# EAGLE design Midi4U (EAGLE 5.11)
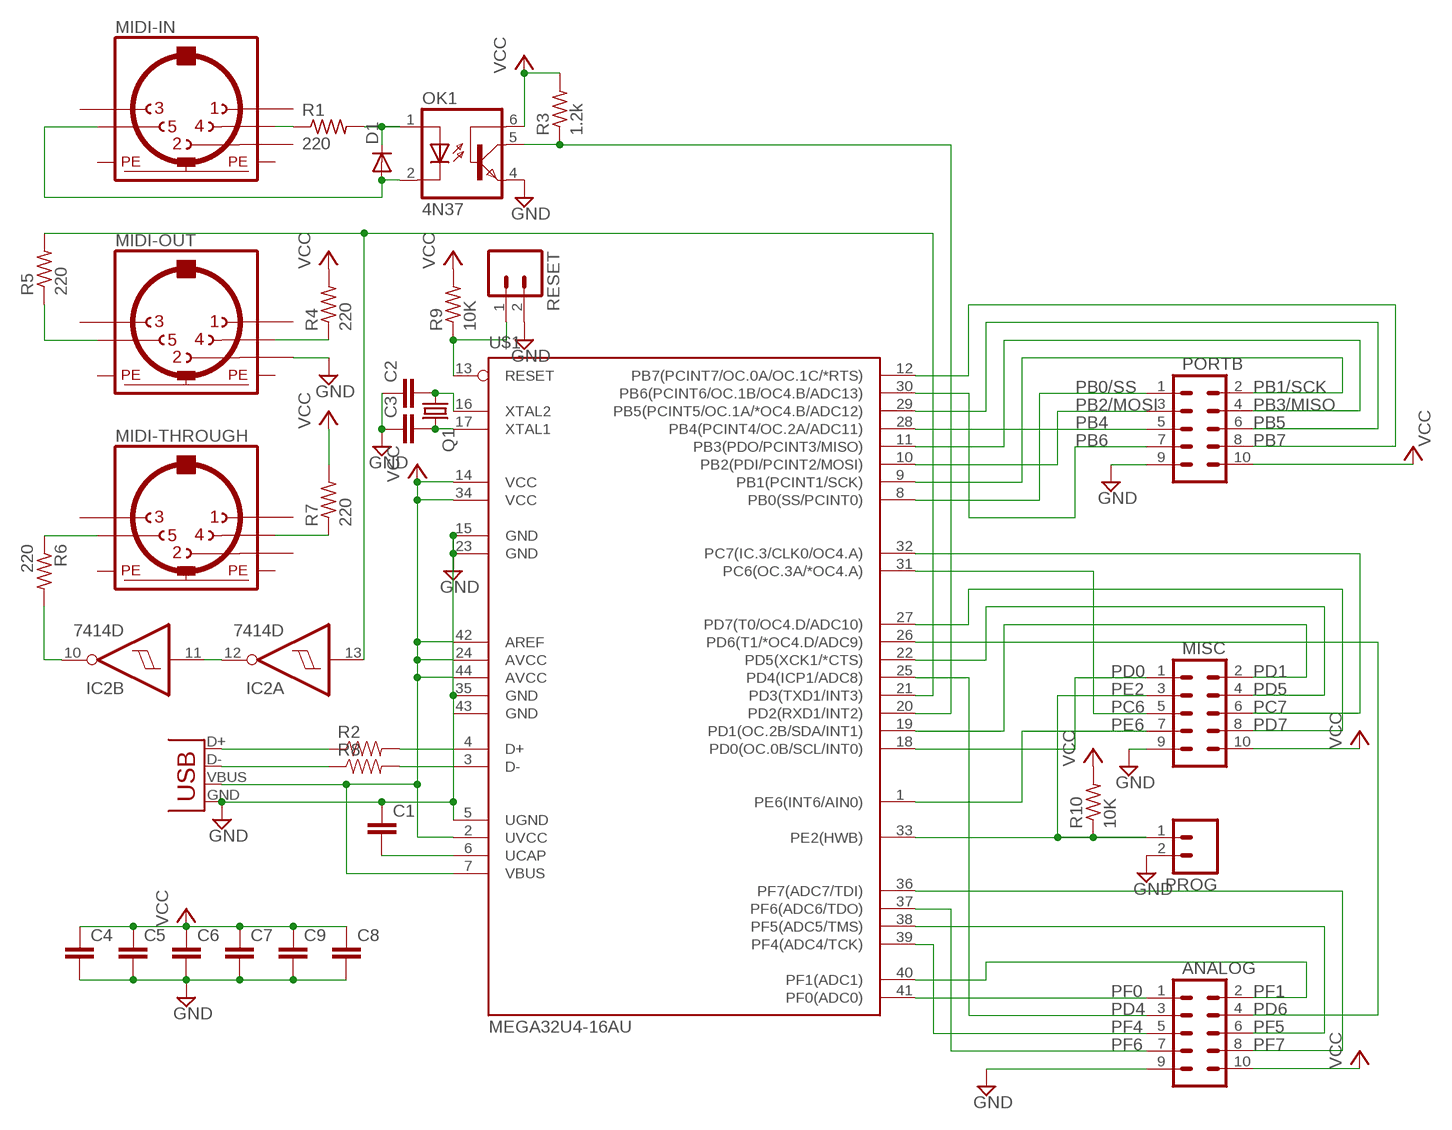
[diagram p0: schematic, sheet 1]

## Parts
ANALOG  M05X2PTH  [AVR_ICSP]
C1  CAP0805  [0805]
C2  CAP0805  [0805]
C3  CAP0805  [0805]
C4  CAP0805  [0805]
C5  CAP0805  [0805]
C6  CAP0805  [0805]
C7  CAP0805  [0805]
C8  CAP0805  [0805]
C9  CAP0805  [0805]
D1  DIODESOD  [SOD-323]
IC2  7414D  [SO14]
MIDI-IN  MAB5SH  [MAB5SH]
MIDI-OUT  MAB5SH  [MAB5SH]
MIDI-THROUGH  MAB5SH  [MAB5SH]
MISC  M05X2PTH  [AVR_ICSP]
OK1  4N37  [DIL06]
PORTB  M05X2PTH  [AVR_ICSP]
PROG  M02PTH  [1X02]
Q1  CRYSTALHC49S  [HC49/S]
R1  220  R-US_R0805  [R0805]
R2  RESISTOR  [0805]
R3  1.2k  R-US_M0805  [M0805]
R4  220  R-US_R0805  [R0805]
R5  220  R-US_R0805  [R0805]
R6  220  R-US_M0805  [M0805]
R7  220  R-US_M0805  [M0805]
R8  RESISTOR  [0805]
R9  10K  R-US_R0805  [R0805]
R10  10K  R-US_R0805  [R0805]
RESET  M02PTH  [1X02]
U$1  MEGA32U4-16AU  [TQFP44]
X1  USBPTH  [USB-B-PTH]

## Nets
GND: ANALOG.9 C1.1 C2.1 C3.1 C4.2 C5.2 C6.2 C7.2 C8.2 C9.2 MIDI-OUT.2 MISC.9 OK1.4(EMI) PORTB.9 PROG.2 RESET.2 U$1.5(UGND) U$1.15(GND) U$1.23(GND) U$1.35(GND) U$1.43(GND) X1.GND
N$1: R9.1 RESET.1 U$1.13(RESET)
N$2: D1.1(C) OK1.1(A) R1.2
N$3: R2.2 U$1.4(D+)
N$4: MIDI-IN.4 R1.1
N$5: MIDI-OUT.5 R5.1
N$6: MIDI-OUT.4 R4.1
N$7: D1.2(A) MIDI-IN.5 OK1.2(C)
N$8: C1.2 U$1.6(UCAP)
N$9: R2.1 X1.D+
N$10: IC2.11(B:I) IC2.12(A:O)
N$11: IC2.10(B:O) R6.2
N$12: MIDI-THROUGH.5 R6.1
N$13: MIDI-THROUGH.4 R7.1
N$14: R8.2 U$1.3(D-)
N$15: R8.1 X1.D-
N$17: C3.2 Q1.2 U$1.17(XTAL1)
N$18: C2.2 Q1.1 U$1.16(XTAL2)
PB0/SS: PORTB.1 U$1.8(PB0(SS/PCINT0))
PB1/SCK: PORTB.2 U$1.9(PB1(PCINT1/SCK))
PB2/MOSI: PORTB.3 U$1.10(PB2(PDI/PCINT2/MOSI))
PB3/MISO: PORTB.4 U$1.11(PB3(PDO/PCINT3/MISO))
PB4: PORTB.5 U$1.28(PB4(PCINT4/OC.2A/ADC11))
PB5: PORTB.6 U$1.29(PB5(PCINT5/OC.1A/*OC4.B/ADC12))
PB6: PORTB.7 U$1.30(PB6(PCINT6/OC.1B/OC4.B/ADC13))
PB7: PORTB.8 U$1.12(PB7(PCINT7/OC.0A/OC.1C/*RTS))
PC6: MISC.5 U$1.31(PC6(OC.3A/*OC4.A))
PC7: MISC.6 U$1.32(PC7(IC.3/CLK0/OC4.A))
PD0: MISC.1 U$1.18(PD0(OC.0B/SCL/INT0))
PD1: MISC.2 U$1.19(PD1(OC.2B/SDA/INT1))
PD4: ANALOG.3 U$1.25(PD4(ICP1/ADC8))
PD5: MISC.4 U$1.22(PD5(XCK1/*CTS))
PD6: ANALOG.4 U$1.26(PD6(T1/*OC4.D/ADC9))
PD7: MISC.8 U$1.27(PD7(T0/OC4.D/ADC10))
PE2: MISC.3 PROG.1 R10.1 U$1.33(PE2(HWB))
PE6: MISC.7 U$1.1(PE6(INT6/AIN0))
PF0: ANALOG.1 U$1.41(PF0(ADC0))
PF1: ANALOG.2 U$1.40(PF1(ADC1))
PF4: ANALOG.5 U$1.39(PF4(ADC4/TCK))
PF5: ANALOG.6 U$1.38(PF5(ADC5/TMS))
PF6: ANALOG.7 U$1.37(PF6(ADC6/TDO))
PF7: ANALOG.8 U$1.36(PF7(ADC7/TDI))
RX: IC2.13(A:I) R5.2 U$1.21(PD3(TXD1/INT3))
TX: OK1.5(COL) R3.1 U$1.20(PD2(RXD1/INT2))
VCC: ANALOG.10 C4.1 C5.1 C6.1 C7.1 C8.1 C9.1 MISC.10 OK1.6(BAS) PORTB.10 R3.2 R4.2 R7.2 R9.2 R10.2 U$1.2(UVCC) U$1.7(VBUS) U$1.14(VCC) U$1.24(AVCC) U$1.34(VCC) U$1.42(AREF) U$1.44(AVCC) X1.VBUS
Unconnected: IC2.1(D:I) IC2.2(D:O) IC2.3(E:I) IC2.4(E:O) IC2.5(F:I) IC2.6(F:O) IC2.8(C:O) IC2.9(C:I) MIDI-IN.1 MIDI-IN.2 MIDI-IN.3 MIDI-OUT.1 MIDI-OUT.3 MIDI-THROUGH.1 MIDI-THROUGH.2 MIDI-THROUGH.3

## Power pins joined to a net without a drawn wire
GND: IC2.7(P:GND)
PE: MIDI-IN.PE MIDI-IN.PE@(PE) MIDI-OUT.PE MIDI-OUT.PE@(PE) MIDI-THROUGH.PE MIDI-THROUGH.PE@(PE)
VCC: IC2.14(P:VCC)

## Library data of the parts
ANALOG MISC PORTB = 3d:M05X2: Header 5x2 Standard 10-pin dual row 0.1" header. Commonly used with AVR-ISP. Use with Spark Fun Electronics SKU: PRT-00778
C1-C9 = 3d:CAP: Capacitor Standard 0603 ceramic capacitor, and 0.1" leaded capacitor.
D1 = 3d:DIODE: Diode These are standard reverse protection diodes and small signal diodes. SMA package can handle up to about 1A. SOD-323 can handle about 200mA. What the SOD-323 package when ordering, there are some mfgs out there that are 5-pin packages.
IC2 = 74xx-eu:74*14: Hex schmitt trigger INVERTER
MIDI-IN MIDI-OUT MIDI-THROUGH = con-hirschmann:MAB5SH: Female CONNECTOR 5 pins 90 deg. with shield, horizontal (DIN 41524)
OK1 = optocoupler:4N37: OPTO COUPLER Source: http://www.fairchildsemi.com/pf/4N/4N35-M.html
PROG RESET = 3d:M02: Header 2 Standard 2-pin 0.1" header. Use with straight break away headers (SKU : PRT-00116), right angle break away headers (PRT-00553), swiss pins (PRT-00743), machine pins (PRT-00117), and female headers (PRT-00115). Molex polarized connector foot print use with SKU : PRT-08233 with associated crimp pins and housings.
Q1 = crystal:CRYSTAL: CRYSTAL
R1 R3-R7 R9 R10 = rcl:R-US_: RESISTOR, American symbol
R2 R8 = 3d:RESISTOR: Resistor Basic schematic elements and footprints for 0603, 1206, and PTH 1/10th watt (small) resistors.
U$1 = at90usb:MEGA32U4: ATmega16U4/ATmega32U4 Atmel USB Microprossessor
X1 = 3d:USB: USB Connectors USB-B-PTH is fully proven SKU : PRT-00139 USB-miniB is fully proven SKU : PRT-00587 USB-A-PCB is untested. USB-A-H is throughly reviewed, but untested. Spark Fun Electronics SKU : PRT-00437 USB-B-SMT is throughly reviewed, but untested. Needs silkscreen touching up. USB-A-S has not been used/tested USB-MB-H has not been used/tested

## Board
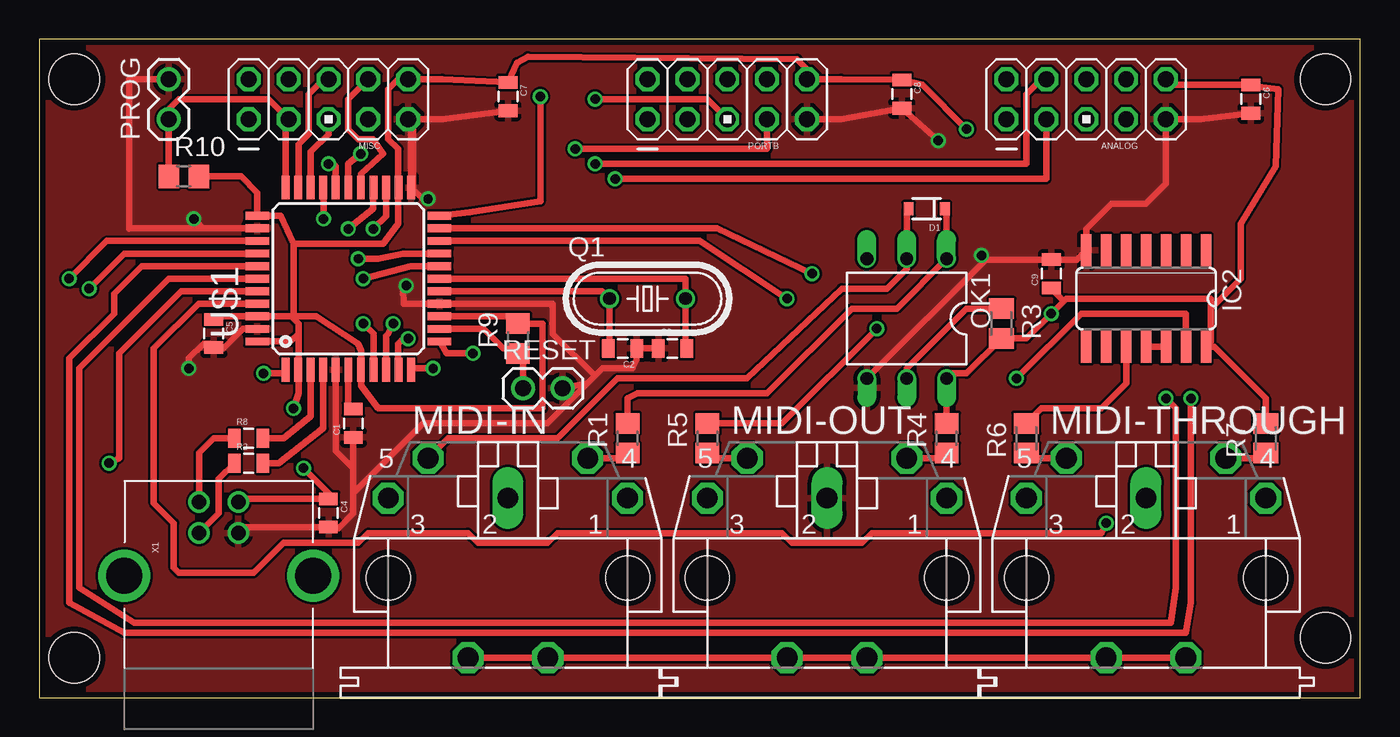
[diagram p1: board, top side]
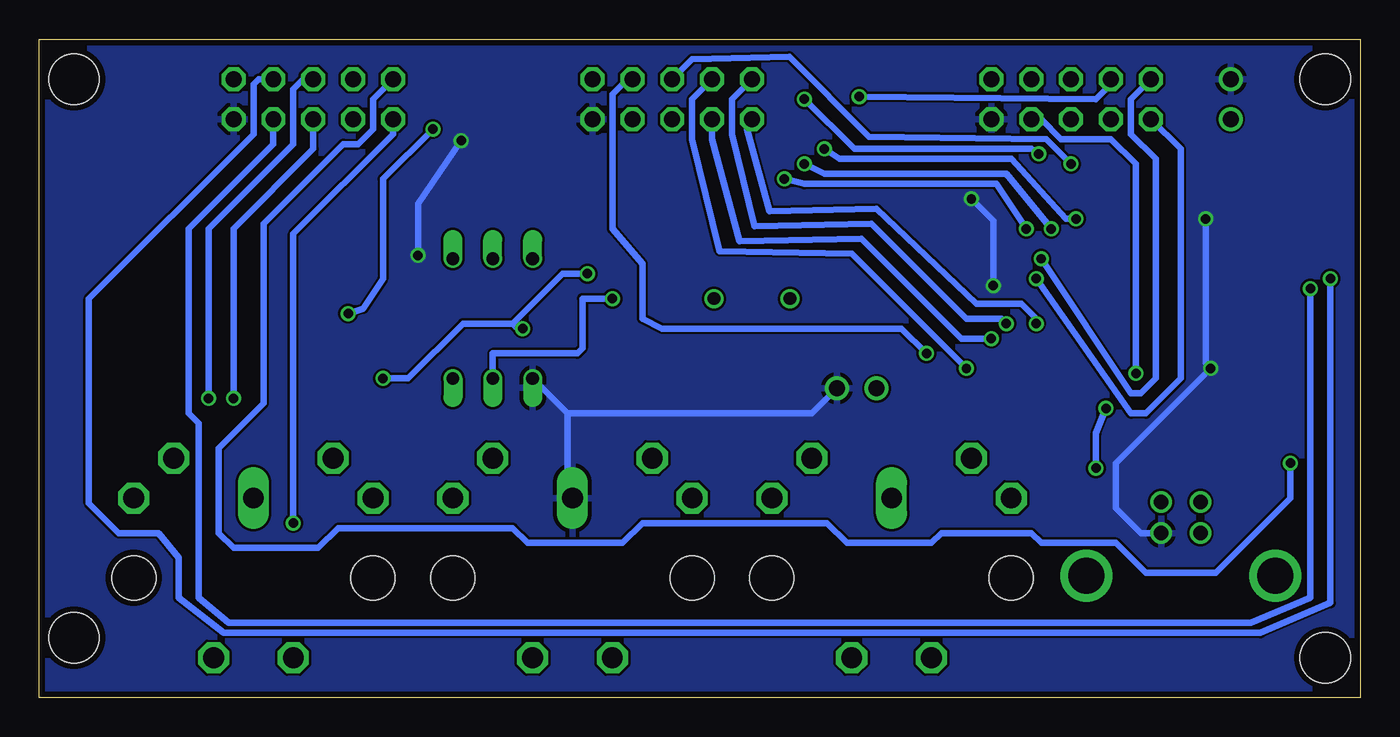
[diagram p2: board, bottom side, seen from below]

Size 84.12 x 41.91 mm. Coordinates in mm from the lower left corner, seen from the top.
Outline: 0,41.91 0,0 84.12,0 84.12,41.9 0,41.9
Copper layers (1*16): Top 0.0356mm / dielectric 1.5011mm / Bottom 0.0356mm
Design rules "LaenPCBOrder": minimum track width 6mil, minimum drill 13mil, track to track 6mil, track to pad 6mil, pad to pad 6mil, via to via 6mil, smd to smd 6mil, copper to edge 15mil, drill to drill 6mil, minimum pad ring 7mil, minimum via ring 7mil, stop-mask expansion 4mil, vias tented up to drill 0mil, thermal gap 10mil
Holes 3.2 mm at 2.22,39.37 2.22,2.54 81.91,3.81 81.91,39.37

### Footprints (pad centres in the part's own frame; a part is rotated, then mirrored left to right if it is on the bottom)
AVR_ICSP = drill 1.016 octagon: 1 -1.27,5.08; 2 1.27,5.08; 3 -1.27,2.54; 4 1.27,2.54; 5 -1.27,0; 6 1.27,0; 7 -1.27,-2.54; 8 1.27,-2.54; 9 -1.27,-5.08; 10 1.27,-5.08
0805 = smd 0.8 x 1.2: 1 -0.9,0; 2 0.9,0
SOD-323 = smd 0.63 x 0.83: 1 -1.15,0; 2 1.15,0
SO14 = smd 0.66 x 2.032: 1 -3.81,-3.073; 2 -2.54,-3.073; 3 -1.27,-3.073; 4 0,-3.073; 5 1.27,-3.073; 6 2.54,-3.073; 7 3.81,-3.073; 8 3.81,3.073; 9 2.54,3.073; 10 1.27,3.073; 11 0,3.073; 12 -1.27,3.073; 13 -2.54,3.073; 14 -3.81,3.073
MAB5SH = drill 1.321 octagon: 1 7.62,5.08; 3 -7.62,5.08; 4 5.08,7.62; 5 -5.08,7.62; PE -2.54,-5.08; PE@ 2.54,-5.08 | drill 1.321 long: 2 0,5.08 | hole 2.794: 7.62,0; -7.62,0
DIL06 = drill 0.813 offset: 1 -2.54,-3.81; 2 0,-3.81; 3 2.54,-3.81; 4 2.54,3.81; 5 0,3.81; 6 -2.54,3.81
1X02 = drill 1.016 round: 1 0,0; 2 2.54,0
HC49/S = drill 0.813 round: 1 -2.413,0; 2 2.413,0
R0805 = smd 1.3 x 1.5: 1 -0.95,0; 2 0.95,0
M0805 = smd 1.3 x 1.6: 1 -0.95,0; 2 0.95,0
TQFP44 = smd 1.5 x 0.5: 1 -5.8,4; 2 -5.8,3.2; 3 -5.8,2.4; 4 -5.8,1.6; 5 -5.8,0.8; 6 -5.8,0; 7 -5.8,-0.8; 8 -5.8,-1.6; 9 -5.8,-2.4; 10 -5.8,-3.2; 11 -5.8,-4; 23 5.8,-4; 24 5.8,-3.2; 25 5.8,-2.4; 26 5.8,-1.6; 27 5.8,-0.8; 28 5.8,0; 29 5.8,0.8; 30 5.8,1.6; 31 5.8,2.4; 32 5.8,3.2; 33 5.8,4 | smd 0.5 x 1.5: 12 -4,-5.8; 13 -3.2,-5.8; 14 -2.4,-5.8; 15 -1.6,-5.8; 16 -0.8,-5.8; 17 0,-5.8; 18 0.8,-5.8; 19 1.6,-5.8; 20 2.4,-5.8; 21 3.2,-5.8; 22 4,-5.8; 34 4,5.8; 35 3.2,5.8; 36 2.4,5.8; 37 1.6,5.8; 38 0.8,5.8; 39 0,5.8; 40 -0.8,5.8; 41 -1.6,5.8; 42 -2.4,5.8; 43 -3.2,5.8; 44 -4,5.8
USB-B-PTH = drill 0.914 round: D+ 0,1.25; D- 1.981,1.25; GND 0,-1.25; VBUS 1.981,-1.25 | drill 2.286 round: P$1 -2.718,-6.02; P$2 -2.718,6.02

### Placement (x,y rotation side)
ANALOG  66.67,38.1 90 top
C1  20,17.46 90 top
C2  37.15,22.22 180 top
C3  40.32,22.22 0 top
C4  18.41,11.75 270 top
C5  11.11,23.18 270 top
C6  77.15,38.1 270 top
C7  29.85,38.26 270 top
C8  54.93,38.42 270 top
C9  64.45,26.99 90 top
D1  56.52,31.11 180 top
IC2  70.48,25.4 180 top
MIDI-IN  29.85,7.62 0 top
MIDI-OUT  50.17,7.62 0 top
MIDI-THROUGH  70.48,7.62 0 top
MISC  18.41,38.1 90 top
OK1  55.25,24.13 180 top
PORTB  43.81,38.1 90 top
PROG  8.26,36.83 90 top
Q1  38.73,25.4 0 top
R1  37.47,16.51 90 top
R2  13.34,14.92 0 top
R3  61.28,23.81 270 top
R4  57.78,16.51 90 top
R5  42.55,16.51 90 top
R6  62.86,16.51 90 top
R7  78.1,16.51 90 top
R8  13.34,16.51 0 top
R9  30.48,22.86 90 top
R10  9.21,33.18 0 top
RESET  30.8,19.68 0 top
U$1  19.68,26.67 90 top
X1  11.43,10.48 90 top

### Tracks (layer width: path | path; a pad name or v marks a point on that pad's centre or on a via)
GND  (via drill 0.6)
  Top 0.406: U$1.23 23.68,36.83 MISC.9 23.81,36.83 | 23.81,36.83 25.66,36.83 C7.2 | C6.2 73.92,36.83 ANALOG.9 71.75,32.7 70.48,31.43 68.26,31.43 66.67,29.84 IC2.7 66.09,27.89 C9.2 60.27,27.89 | PORTB.9 51.06,36.83 C8.2 v57.26,35.45 | C3.1 C2.1 38.05,21.54 37.78,20.95 35.88,20.95 35.4,20.48 | 34.92,20 32.39,17.46 24.45,17.46 20,13.02 | 34.92,20 35.4,20.48 | 20,13.02 20,11.75 19.05,10.79 18.47,10.79 C4.2 13.05,10.85 X1.GND | 20,13.02 20,14.61 | 20,14.61 C1.1 | U$1.5 18.89,15.72 20,14.61 | U$1.23 23.81,32.47 23.81,36.83 | 34.92,20 RESET.2 | U$1.43 12.99,23.47 11.75,22.22 11.16,22.22 C5.2 10.85,22.54 10.48,22.54 9.53,21.59 v9.53,20.95 | PROG.2 5.71,39.37 5.71,29.84 5.74,29.87 U$1.35 10.45,29.87 v9.84,30.48 | OK1.4 60.27,27.89 | 35.4,20.48 32.7,23.18 32.7,25.08 32.69,25.07 U$1.15 23.19,25.07 23.18,26.04 v23.37,26.22 | 60.27,27.89 v60.01,28.15 | v24.77,31.75 24.41,31.75 U$1.23
  Bottom 0.406: X1.GND 13.97,10.48 15.56,12.06 15.56,14.92 v9.53,20.95 9.84,21.27 v9.84,30.48 | 50.48,18.1 OK1.4 | 50.48,18.1 50.48,13.02 MIDI-OUT.2 | v57.26,35.45 60.01,31.43 v60.01,28.15 | v23.37,26.22 23.37,30.35 v24.77,31.75 | 50.48,18.1 34.92,18.1 RESET.2
  pour Bottom: -0.32,41.91 84.45,41.91 84.45,0 -0.32,0
  pour Top: -0.32,41.91 84.45,41.91 84.45,0 -0.32,0
N$1
  Top 0.406: RESET.1 30.8,21.91 R9.1 30.48,22.22 29.53,22.22 28.28,23.47 U$1.13
N$2
  Top 0.406: D1.1 57.78,30.68 OK1.1 54.61,24.77 51.75,24.77 46.36,19.37 38.1,19.37 37.47,19.05 R1.2
N$3
  Top 0.406: U$1.4 18.09,17.13 15.24,14.92 R2.2
N$4
  Top 0.406: MIDI-IN.4 37.14,15.24 R1.1
N$5
  Top 0.406: MIDI-OUT.5 42.86,15.24 R5.1
N$6
  Top 0.406: MIDI-OUT.4 57.47,15.24 R4.1
N$7
  Top 0.406: D1.2 55.25,31 OK1.2 55.25,27.3 53.97,26.04 51.12,26.04 45.08,20.32 36.83,20.32 33.02,16.51 26.04,16.51 MIDI-IN.5
N$8
  Top 0.406: U$1.6 19.68,18.73 20,18.41 C1.2
N$9
  Top 0.406: X1.D+ 10.18,10.5 11.43,11.75 11.43,13.92 R2.1
N$10
  Top 0.406: IC2.11 IC2.12
N$11
  Top 0.406: IC2.10 69.22,20 67.63,18.41 63.82,18.41 R6.2
N$12
  Top 0.406: MIDI-THROUGH.5 63.19,15.24 R6.1
N$13
  Top 0.406: MIDI-THROUGH.4 77.78,15.24 R7.1
N$14
  Top 0.406: R8.2 15.56,16.51 17.29,17.92 U$1.3
N$15
  Top 0.406: X1.D- 10.18,15.58 11.11,16.51 R8.1
N$17
  Top 0.406: U$1.17 41.15,26.67 Q1.2 41.15,22.3 C3.2
N$18
  Top 0.406: U$1.16 35.85,25.87 Q1.1 36.32,22.3 C2.2
PB0/SS  (via drill 0.6)
  Top 0.406: U$1.8 21.29,23.16 v20.64,23.81
  Bottom 0.406: v20.64,23.81 20.64,24.13 21.59,25.08 24.45,25.08 30.8,31.11 37.62,30.96 39.05,36.2 38.42,36.51 PORTB.1
PB1/SCK  (via drill 0.6)
  Top 0.406: v22.54,23.81 22.23,23.18 22.09,23.04 U$1.9
  Bottom 0.406: PORTB.2 40,38.1 40,35.88 38.58,30 31.11,30.16 25.08,24.13 22.86,24.13 v22.54,23.81
PB2/MOSI  (via drill 0.6)
  Top 0.406: v23.5,22.86 23.18,22.86 22.86,22.54 22.86,20.89 U$1.10
  Bottom 0.406: PORTB.3 41.28,35.56 39.53,29.05 31.75,29.21 25.4,22.86 v23.5,22.86
PB3/MISO  (via drill 0.6)
  Top 0.406: v25.08,20.95 23.77,20.95 U$1.11
  Bottom 0.406: PORTB.4 42.55,38.1 42.55,35.56 40.8,28.42 32.39,28.26 v25.08,20.95
PB4  (via drill 0.6)
  Top 0.406: U$1.28 19.68,33.97 v20.48,34.61 | v35.4,38.1 42.55,38.1 PORTB.5
  Bottom 0.406: v20.48,34.61 20.96,34.93 32.23,34.93 v35.4,38.1
PB5  (via drill 0.6)
  Top 0.406: U$1.29 18.89,33.82 v18.41,33.97
  Bottom 0.406: v18.41,33.97 20,35.56 31.27,35.72 36.35,40.8 42.55,40.64 PORTB.6
PB6  (via drill 0.6)
  Top 0.406: PORTB.7 46.36,34.93 v34.13,34.93 | v18.1,30.48 18.1,32.46 U$1.30
  Bottom 0.406: v34.13,34.93 33.18,34.29 22.23,34.29 18.73,30.48 v18.1,30.48
PB7  (via drill 0.6)
  Top 0.406: v27.62,21.91 25.93,21.91 U$1.12
  Bottom 0.406: PORTB.8 46.67,39.37 47.62,38.42 47.62,29.84 45.72,27.62 45.72,24.13 44.45,23.5 29.21,23.5 v27.62,21.91
PC6
  Top 0.406: U$1.31 17.29,34.75 18.41,35.88 MISC.5
PC7
  Top 0.406: MISC.6 18.1,39.37 17.14,38.42 17.14,35.88 16.51,35.24 16.51,32.5 U$1.32
PD0  (via drill 0.6)
  Top 0.406: U$1.18 23.66,27.47 v20.64,26.67
  Bottom 0.406: v20.64,26.67 14.61,18.1 13.65,18.1 11.43,20.32 11.43,34.93 MISC.1
PD1  (via drill 0.6)
  Top 0.406: v20.32,27.94 21.59,27.94 23.18,28.26 25.47,28.26 U$1.19
  Bottom 0.406: MISC.2 14.61,38.1 14.61,35.88 13.02,34.29 13.02,20.32 13.97,19.37 14.61,19.37 v20.32,27.94
PD4  (via drill 0.6)
  Top 0.406: U$1.25 22.09,30.66 v21.27,29.84 | v36.67,33.02 64.13,33.02 ANALOG.3
  Bottom 0.406: v21.27,29.84 23.18,32.7 35.4,32.7 v36.67,33.02
PD5  (via drill 0.6)
  Top 0.406: U$1.22 27.39,30.88 31.91,31.59 v31.91,38.26
  Bottom 0.406: MISC.4 15.88,39.05 16.83,38.1 v31.91,38.26
PD6  (via drill 0.6)
  Top 0.406: ANALOG.4 63.82,39.37 62.86,38.42 62.86,33.97 v35.4,33.97 | v19.68,29.84 21.27,31.11 21.27,32.46 U$1.26
  Bottom 0.406: v35.4,33.97 34.13,33.34 22.54,33.34 v19.68,29.84
PD7
  Top 0.406: U$1.27 20.48,33.34 21.91,34.61 21.27,35.56 20.32,35.56 19.68,36.2 19.68,38.1 MISC.8
PE
  Top 0.406: MIDI-IN.PE MIDI-IN.PE@ MIDI-OUT.PE MIDI-OUT.PE@ MIDI-THROUGH.PE MIDI-THROUGH.PE@
PE2
  Top 0.406: U$1.33 15.68,36.64 MISC.3 14.61,38.1 8.89,38.1 8.26,37.47 PROG.1 R10.1
PE6  (via drill 0.6)
  Top 0.406: v14.29,20.64 15.45,20.64 U$1.1
  Bottom 0.406: MISC.7 20.32,36.83 19.05,35.56 15.88,35.56 14.29,33.97 v14.29,20.64
PF0  (via drill 0.6)
  Top 0.406: U$1.41 10.15,25.07 7.3,22.22 7.3,12.38 8.57,11.11 8.57,8.26 8.89,7.94 13.65,7.94 15.56,9.84 20.32,9.84 20.96,10.48 27.31,10.48 27.94,9.84 32.39,9.84 33.02,10.48 47.31,10.48 47.94,9.84 52.39,9.84 53.02,10.48 67.63,10.48 v67.94,11.11
  Bottom 0.406: v67.94,11.11 67.94,29.53 61.59,35.88 ANALOG.1
PF1  (via drill 0.6)
  Top 0.406: U$1.40 9.04,25.87 5.08,21.91 5.08,15.24 v4.45,14.92
  Bottom 0.406: v4.45,14.92 4.45,12.7 9.21,7.94 13.65,7.94 15.56,9.84 20.32,9.84 20.96,10.48 26.67,10.48 27.31,9.84 32.7,9.84 33.97,11.11 45.72,11.11 46.99,9.84 53.02,9.84 53.97,10.79 65.09,10.79 66.36,9.53 71.75,9.53 72.71,10.48 72.71,15.88 69.85,18.73 69.85,30.16 64.77,35.24 63.82,35.24 62.86,36.2 62.86,38.1 ANALOG.2
PF4  (via drill 0.6)
  Top 0.406: U$1.39 8.26,26.67 2.54,20.95 2.54,6.98 6.03,4.76 72.07,4.76 72.39,6.98 72.39,18.41 v71.75,19.05
  Bottom 0.406: v71.75,19.05 71.75,29.84 66.67,34.93 ANALOG.5
PF5  (via drill 0.6)
  Top 0.406: U$1.38 6.52,27.47 4.76,25.72 4.76,24.45 1.91,21.59 1.91,6.03 5.4,4.13 73.02,4.13 73.34,6.03 v73.34,19.05
  Bottom 0.406: v73.34,19.05 73.34,29.84 67.94,35.24 67.94,38.74 67.31,39.37 ANALOG.6
PF6  (via drill 0.6)
  Top 0.406: U$1.37 5.41,28.27 v3.18,26.04
  Bottom 0.406: ANALOG.7 69.22,35.24 74.61,29.84 74.61,18.1 73.98,17.46 73.98,6.35 72.07,4.76 6.98,4.76 3.18,6.35 v3.18,26.04
PF7  (via drill 0.6)
  Top 0.406: U$1.36 4.3,29.07 v1.91,26.67
  Bottom 0.406: v1.91,26.67 1.91,6.03 6.35,4.13 72.39,4.13 75.25,6.35 75.25,8.89 76.52,10.48 79.06,10.48 80.96,12.38 80.96,25.4 70.48,35.88 70.48,39.05 70.17,39.37 ANALOG.8
RX  (via drill 0.6)
  Top 0.406: U$1.21 43.16,29.87 v49.21,26.99 | IC2.13 73.02,24.45 66.36,24.45 v62.23,20.32 | R5.2 47.31,17.46 v53.34,23.5
  Bottom 0.406: v62.23,20.32 60.64,20.32 57.15,23.81 53.97,23.81 | 53.97,23.81 50.8,26.99 v49.21,26.99 | v53.34,23.5 53.66,23.5 53.97,23.81
TX  (via drill 0.6)
  Top 0.406: OK1.5 55.25,20.95 59.05,24.77 R3.1 | U$1.20 42.05,29.07 v47.62,25.4
  Bottom 0.406: v47.62,25.4 49.53,25.4 49.53,22.22 49.85,21.91 55.25,21.91 OK1.5
VCC  (via drill 0.6)
  Top 0.406: X1.VBUS 12.87,12.65 C4.1 18.41,13.02 v16.83,14.61 | R4.2 OK1.6 58.1,20.64 59.05,20.64 R3.2 62.87,22.86 v64.45,24.45 65.25,25.24 | 65.25,25.24 65.41,25.4 74.61,25.4 74.61,24.77 | 74.61,24.77 74.61,22.64 IC2.14 74.83,22.33 78.1,19.05 R7.2 | 78.74,33.81 76.52,30.16 76.52,26.67 74.61,24.77 | C9.1 64.45,26.04 65.25,25.24 | v16.19,18.41 16.51,19.37 16.51,20.84 U$1.2 16.51,20.89 16.51,23.18 | U$1.14 30.65,24.27 R9.2 31.12,23.81 32.07,23.81 32.07,18.41 21.59,18.41 20.48,19.84 U$1.7 20.48,22.07 20.32,22.54 17.64,24.27 16.19,24.27 | U$1.42 11.3,24.27 C5.1 | 78.74,33.81 | 78.74,33.81 | 78.74,33.81 78.9,38.74 77.63,38.89 77.05,39.05 C6.1 72.12,39 ANALOG.10 | U$1.42 16.05,24.27 16.51,23.81 16.51,23.18 | U$1.42 16.19,24.27 | 16.19,28.89 15.37,30.67 U$1.34 13.89,32.15 12.86,33.18 R10.2 | 16.19,24.27 16.19,28.89 | 16.19,28.89 21.91,28.89 22.86,30.16 22.86,32.45 U$1.24 22.86,32.5 22.86,34.93 22.23,35.56 22.23,38.74 22.86,39.37 MISC.10 25.66,39.37 C7.1 30.43,40.43 31.11,40.8 48.26,40.64 48.89,40.01 PORTB.10 51.06,39.37 C8.1 56.25,39 v59.05,36.2 | U$1.44 16,22.67 16.51,23.18 | R10.2
  Bottom 0.406: v16.83,14.61 16.83,16.83 v16.19,18.41 | v59.05,36.2 62.23,33.02 62.23,26.67 63.5,24.77 v64.45,24.45